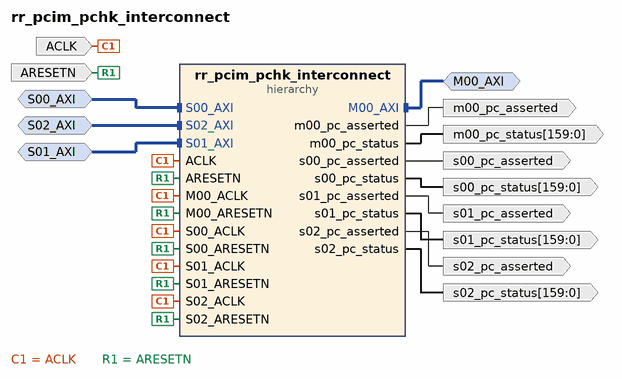
[diagram p0: block diagram of the top level]
# Vivado block design rr_pcim_pchk_interconnect, xcvu9p-flgb2104-2-i, Vivado 2020.2
create_bd_design rr_pcim_pchk_interconnect

create_bd_intf_port -mode Slave -vlnv xilinx.com:interface:aximm_rtl:1.0 S00_AXI
set_property -dict [list \
  CONFIG.ADDR_WIDTH 64 \
  CONFIG.ARUSER_WIDTH 0 \
  CONFIG.AWUSER_WIDTH 0 \
  CONFIG.BUSER_WIDTH 0 \
  CONFIG.DATA_WIDTH 512 \
  CONFIG.FREQ_HZ 250000000 \
  CONFIG.HAS_BRESP 1 \
  CONFIG.HAS_BURST 1 \
  CONFIG.HAS_CACHE 1 \
  CONFIG.HAS_LOCK 1 \
  CONFIG.HAS_PROT 1 \
  CONFIG.HAS_QOS 1 \
  CONFIG.HAS_REGION 1 \
  CONFIG.HAS_RRESP 1 \
  CONFIG.HAS_WSTRB 1 \
  CONFIG.ID_WIDTH 14 \
  CONFIG.MAX_BURST_LENGTH 256 \
  CONFIG.NUM_READ_OUTSTANDING 32 \
  CONFIG.NUM_READ_THREADS 16 \
  CONFIG.NUM_WRITE_OUTSTANDING 32 \
  CONFIG.NUM_WRITE_THREADS 16 \
  CONFIG.PROTOCOL AXI4 \
  CONFIG.READ_WRITE_MODE READ_WRITE \
  CONFIG.RUSER_BITS_PER_BYTE 0 \
  CONFIG.RUSER_WIDTH 0 \
  CONFIG.SUPPORTS_NARROW_BURST 1 \
  CONFIG.WUSER_BITS_PER_BYTE 0 \
  CONFIG.WUSER_WIDTH 0 \
] [get_bd_intf_ports S00_AXI]
create_bd_intf_port -mode Master -vlnv xilinx.com:interface:aximm_rtl:1.0 M00_AXI
set_property -dict [list \
  CONFIG.ADDR_WIDTH 64 \
  CONFIG.DATA_WIDTH 512 \
  CONFIG.FREQ_HZ 250000000 \
  CONFIG.NUM_READ_OUTSTANDING 32 \
  CONFIG.NUM_WRITE_OUTSTANDING 32 \
  CONFIG.PROTOCOL AXI4 \
] [get_bd_intf_ports M00_AXI]
create_bd_intf_port -mode Slave -vlnv xilinx.com:interface:aximm_rtl:1.0 S01_AXI
set_property -dict [list \
  CONFIG.ADDR_WIDTH 64 \
  CONFIG.ARUSER_WIDTH 0 \
  CONFIG.AWUSER_WIDTH 0 \
  CONFIG.BUSER_WIDTH 0 \
  CONFIG.DATA_WIDTH 512 \
  CONFIG.FREQ_HZ 250000000 \
  CONFIG.HAS_BRESP 1 \
  CONFIG.HAS_BURST 1 \
  CONFIG.HAS_CACHE 1 \
  CONFIG.HAS_LOCK 1 \
  CONFIG.HAS_PROT 1 \
  CONFIG.HAS_QOS 1 \
  CONFIG.HAS_REGION 1 \
  CONFIG.HAS_RRESP 1 \
  CONFIG.HAS_WSTRB 1 \
  CONFIG.ID_WIDTH 14 \
  CONFIG.MAX_BURST_LENGTH 256 \
  CONFIG.NUM_READ_OUTSTANDING 32 \
  CONFIG.NUM_READ_THREADS 16 \
  CONFIG.NUM_WRITE_OUTSTANDING 32 \
  CONFIG.NUM_WRITE_THREADS 16 \
  CONFIG.PROTOCOL AXI4 \
  CONFIG.READ_WRITE_MODE READ_WRITE \
  CONFIG.RUSER_BITS_PER_BYTE 0 \
  CONFIG.RUSER_WIDTH 0 \
  CONFIG.SUPPORTS_NARROW_BURST 1 \
  CONFIG.WUSER_BITS_PER_BYTE 0 \
  CONFIG.WUSER_WIDTH 0 \
] [get_bd_intf_ports S01_AXI]
create_bd_intf_port -mode Slave -vlnv xilinx.com:interface:aximm_rtl:1.0 S02_AXI
set_property -dict [list \
  CONFIG.ADDR_WIDTH 64 \
  CONFIG.ARUSER_WIDTH 0 \
  CONFIG.AWUSER_WIDTH 0 \
  CONFIG.BUSER_WIDTH 0 \
  CONFIG.DATA_WIDTH 512 \
  CONFIG.FREQ_HZ 250000000 \
  CONFIG.HAS_BRESP 1 \
  CONFIG.HAS_BURST 1 \
  CONFIG.HAS_CACHE 1 \
  CONFIG.HAS_LOCK 1 \
  CONFIG.HAS_PROT 1 \
  CONFIG.HAS_QOS 1 \
  CONFIG.HAS_REGION 1 \
  CONFIG.HAS_RRESP 1 \
  CONFIG.HAS_WSTRB 1 \
  CONFIG.ID_WIDTH 14 \
  CONFIG.MAX_BURST_LENGTH 256 \
  CONFIG.NUM_READ_OUTSTANDING 32 \
  CONFIG.NUM_READ_THREADS 16 \
  CONFIG.NUM_WRITE_OUTSTANDING 32 \
  CONFIG.NUM_WRITE_THREADS 16 \
  CONFIG.PROTOCOL AXI4 \
  CONFIG.READ_WRITE_MODE READ_WRITE \
  CONFIG.RUSER_BITS_PER_BYTE 0 \
  CONFIG.RUSER_WIDTH 0 \
  CONFIG.SUPPORTS_NARROW_BURST 1 \
  CONFIG.WUSER_BITS_PER_BYTE 0 \
  CONFIG.WUSER_WIDTH 0 \
] [get_bd_intf_ports S02_AXI]
create_bd_port -dir I -type clk ACLK
set_property -dict {CONFIG.ASSOCIATED_BUSIF S00_AXI:M00_AXI:S01_AXI:S02_AXI CONFIG.FREQ_HZ 250000000} [get_bd_ports ACLK]
create_bd_port -dir I -type rst ARESETN
create_bd_port -dir O -from 159 -to 0 s01_pc_status
create_bd_port -dir O s01_pc_asserted
create_bd_port -dir O -from 159 -to 0 s00_pc_status
create_bd_port -dir O s00_pc_asserted
create_bd_port -dir O -from 159 -to 0 s02_pc_status
create_bd_port -dir O s02_pc_asserted
create_bd_port -dir O -from 159 -to 0 m00_pc_status
create_bd_port -dir O m00_pc_asserted

create_bd_cell -type hier rr_pcim_pchk_interconnect
set_property -dict [list \
  CONFIG.ENABLE_ADVANCED_OPTIONS 1 \
  CONFIG.ENABLE_PROTOCOL_CHECKERS 1 \
  CONFIG.M00_HAS_REGSLICE 4 \
  CONFIG.M01_HAS_REGSLICE 4 \
  CONFIG.M02_HAS_REGSLICE 4 \
  CONFIG.M03_HAS_REGSLICE 4 \
  CONFIG.NUM_MI 1 \
  CONFIG.NUM_SI 3 \
  CONFIG.PCHK_MAX_RD_BURSTS 32 \
  CONFIG.PCHK_MAX_WR_BURSTS 32 \
  CONFIG.S00_ARB_PRIORITY 1 \
  CONFIG.S00_HAS_REGSLICE 4 \
  CONFIG.S01_ARB_PRIORITY 1 \
  CONFIG.S01_HAS_REGSLICE 4 \
  CONFIG.S02_HAS_REGSLICE 4 \
] [get_bd_cells rr_pcim_pchk_interconnect]

# ---- hierarchy /rr_pcim_pchk_interconnect ----
current_bd_instance /rr_pcim_pchk_interconnect
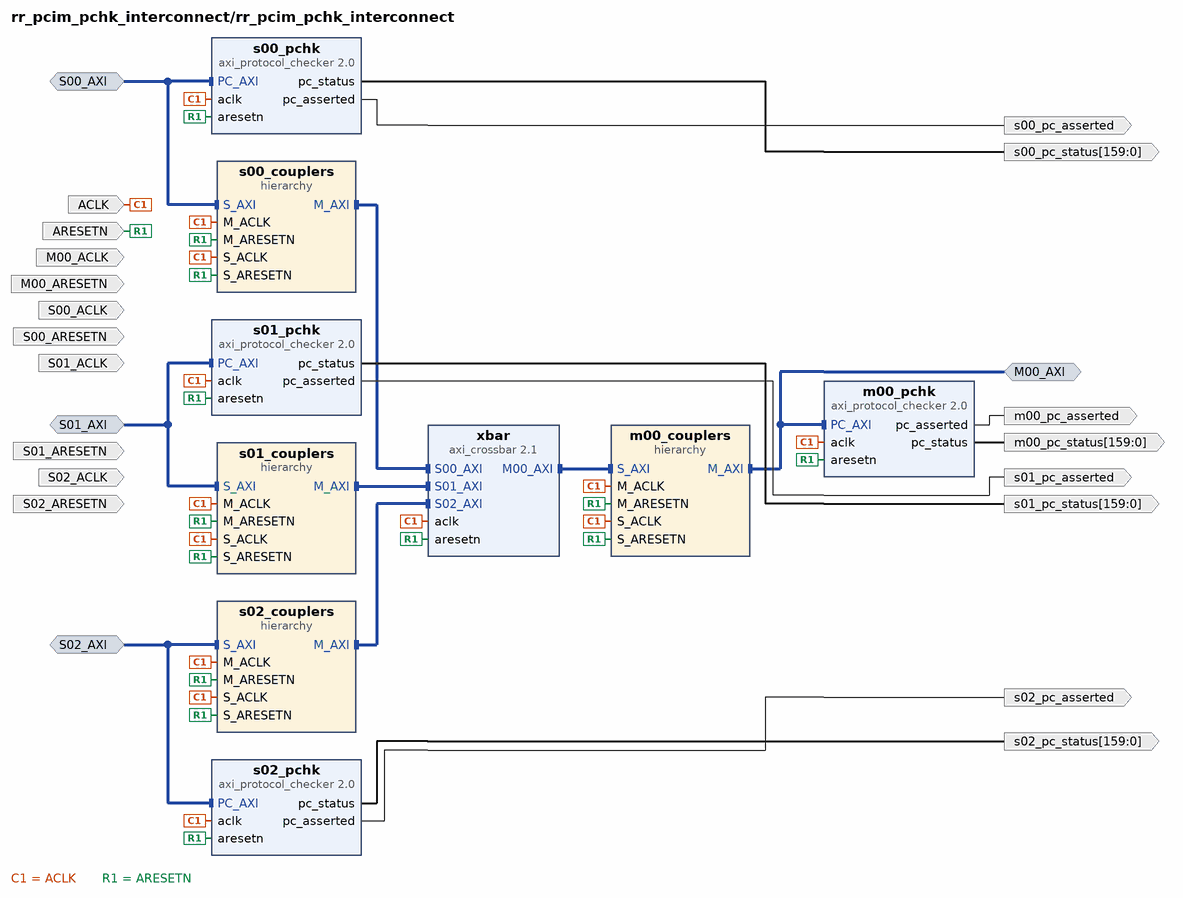
[diagram p1: block diagram inside /rr_pcim_pchk_interconnect]
create_bd_intf_pin -mode Slave -vlnv xilinx.com:interface:aximm_rtl:1.0 S00_AXI
create_bd_intf_pin -mode Master -vlnv xilinx.com:interface:aximm_rtl:1.0 M00_AXI
create_bd_intf_pin -mode Slave -vlnv xilinx.com:interface:aximm_rtl:1.0 S01_AXI
create_bd_intf_pin -mode Slave -vlnv xilinx.com:interface:aximm_rtl:1.0 S02_AXI
create_bd_pin -dir I -type clk ACLK
create_bd_pin -dir I -type rst ARESETN
create_bd_pin -dir I -type clk S00_ACLK
create_bd_pin -dir I -type rst S00_ARESETN
create_bd_pin -dir I -type clk M00_ACLK
create_bd_pin -dir I -type rst M00_ARESETN
create_bd_pin -dir I -type clk S01_ACLK
create_bd_pin -dir I -type rst S01_ARESETN
create_bd_pin -dir I -type clk S02_ACLK
create_bd_pin -dir I -type rst S02_ARESETN
create_bd_pin -dir O -from 159 -to 0 s01_pc_status
create_bd_pin -dir O s01_pc_asserted
create_bd_pin -dir O -from 159 -to 0 s00_pc_status
create_bd_pin -dir O s00_pc_asserted
create_bd_pin -dir O -from 159 -to 0 s02_pc_status
create_bd_pin -dir O s02_pc_asserted
create_bd_pin -dir O -from 159 -to 0 m00_pc_status
create_bd_pin -dir O m00_pc_asserted

create_bd_cell -type ip -vlnv xilinx.com:ip:axi_crossbar:2.1 xbar
set_property -dict [list \
  CONFIG.NUM_MI 1 \
  CONFIG.NUM_SI 3 \
  CONFIG.S00_ARB_PRIORITY 1 \
  CONFIG.S01_ARB_PRIORITY 1 \
  CONFIG.S02_ARB_PRIORITY 0 \
  CONFIG.STRATEGY 0 \
] [get_bd_cells xbar]
create_bd_cell -type hier s00_couplers
create_bd_cell -type hier s01_couplers
create_bd_cell -type hier s02_couplers
create_bd_cell -type hier m00_couplers
create_bd_cell -type ip -vlnv xilinx.com:ip:axi_protocol_checker:2.0 s00_pchk
set_property -dict [list \
  CONFIG.MAX_AR_WAITS 0 \
  CONFIG.MAX_AW_WAITS 0 \
  CONFIG.MAX_B_WAITS 0 \
  CONFIG.MAX_RD_BURSTS 32 \
  CONFIG.MAX_R_WAITS 0 \
  CONFIG.MAX_WR_BURSTS 32 \
  CONFIG.MAX_W_WAITS 0 \
] [get_bd_cells s00_pchk]
create_bd_cell -type ip -vlnv xilinx.com:ip:axi_protocol_checker:2.0 s01_pchk
set_property -dict [list \
  CONFIG.MAX_AR_WAITS 0 \
  CONFIG.MAX_AW_WAITS 0 \
  CONFIG.MAX_B_WAITS 0 \
  CONFIG.MAX_RD_BURSTS 32 \
  CONFIG.MAX_R_WAITS 0 \
  CONFIG.MAX_WR_BURSTS 32 \
  CONFIG.MAX_W_WAITS 0 \
] [get_bd_cells s01_pchk]
create_bd_cell -type ip -vlnv xilinx.com:ip:axi_protocol_checker:2.0 s02_pchk
set_property -dict [list \
  CONFIG.MAX_AR_WAITS 0 \
  CONFIG.MAX_AW_WAITS 0 \
  CONFIG.MAX_B_WAITS 0 \
  CONFIG.MAX_RD_BURSTS 32 \
  CONFIG.MAX_R_WAITS 0 \
  CONFIG.MAX_WR_BURSTS 32 \
  CONFIG.MAX_W_WAITS 0 \
] [get_bd_cells s02_pchk]
create_bd_cell -type ip -vlnv xilinx.com:ip:axi_protocol_checker:2.0 m00_pchk
set_property -dict [list \
  CONFIG.MAX_AR_WAITS 0 \
  CONFIG.MAX_AW_WAITS 0 \
  CONFIG.MAX_B_WAITS 0 \
  CONFIG.MAX_RD_BURSTS 32 \
  CONFIG.MAX_R_WAITS 0 \
  CONFIG.MAX_WR_BURSTS 32 \
  CONFIG.MAX_W_WAITS 0 \
] [get_bd_cells m00_pchk]

# ---- hierarchy /rr_pcim_pchk_interconnect/s00_couplers ----
current_bd_instance /rr_pcim_pchk_interconnect/s00_couplers
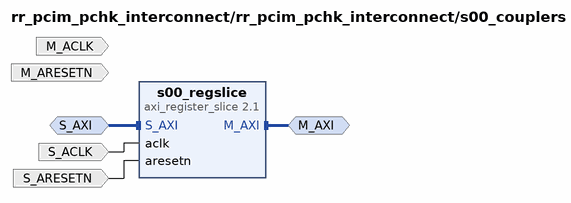
[diagram p2: block diagram inside /rr_pcim_pchk_interconnect/s00_couplers]
create_bd_intf_pin -mode Master -vlnv xilinx.com:interface:aximm_rtl:1.0 M_AXI
create_bd_intf_pin -mode Slave -vlnv xilinx.com:interface:aximm_rtl:1.0 S_AXI
create_bd_pin -dir I -type clk M_ACLK
create_bd_pin -dir I -type rst M_ARESETN
create_bd_pin -dir I -type clk S_ACLK
create_bd_pin -dir I -type rst S_ARESETN

create_bd_cell -type ip -vlnv xilinx.com:ip:axi_register_slice:2.1 s00_regslice

# ---- hierarchy /rr_pcim_pchk_interconnect/s01_couplers ----
current_bd_instance /rr_pcim_pchk_interconnect/s01_couplers
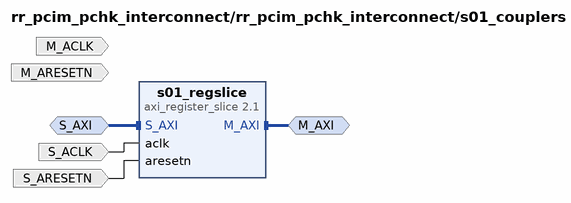
[diagram p3: block diagram inside /rr_pcim_pchk_interconnect/s01_couplers]
create_bd_intf_pin -mode Master -vlnv xilinx.com:interface:aximm_rtl:1.0 M_AXI
create_bd_intf_pin -mode Slave -vlnv xilinx.com:interface:aximm_rtl:1.0 S_AXI
create_bd_pin -dir I -type clk M_ACLK
create_bd_pin -dir I -type rst M_ARESETN
create_bd_pin -dir I -type clk S_ACLK
create_bd_pin -dir I -type rst S_ARESETN

create_bd_cell -type ip -vlnv xilinx.com:ip:axi_register_slice:2.1 s01_regslice

# ---- hierarchy /rr_pcim_pchk_interconnect/s02_couplers ----
current_bd_instance /rr_pcim_pchk_interconnect/s02_couplers
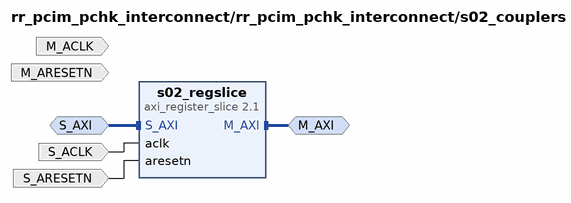
[diagram p4: block diagram inside /rr_pcim_pchk_interconnect/s02_couplers]
create_bd_intf_pin -mode Master -vlnv xilinx.com:interface:aximm_rtl:1.0 M_AXI
create_bd_intf_pin -mode Slave -vlnv xilinx.com:interface:aximm_rtl:1.0 S_AXI
create_bd_pin -dir I -type clk M_ACLK
create_bd_pin -dir I -type rst M_ARESETN
create_bd_pin -dir I -type clk S_ACLK
create_bd_pin -dir I -type rst S_ARESETN

create_bd_cell -type ip -vlnv xilinx.com:ip:axi_register_slice:2.1 s02_regslice

# ---- hierarchy /rr_pcim_pchk_interconnect/m00_couplers ----
current_bd_instance /rr_pcim_pchk_interconnect/m00_couplers
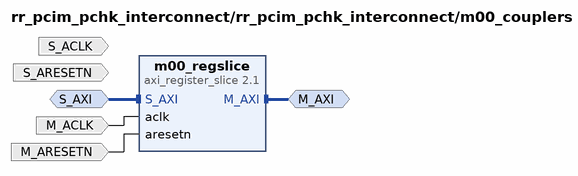
[diagram p5: block diagram inside /rr_pcim_pchk_interconnect/m00_couplers]
create_bd_intf_pin -mode Master -vlnv xilinx.com:interface:aximm_rtl:1.0 M_AXI
create_bd_intf_pin -mode Slave -vlnv xilinx.com:interface:aximm_rtl:1.0 S_AXI
create_bd_pin -dir I -type clk M_ACLK
create_bd_pin -dir I -type rst M_ARESETN
create_bd_pin -dir I -type clk S_ACLK
create_bd_pin -dir I -type rst S_ARESETN

create_bd_cell -type ip -vlnv xilinx.com:ip:axi_register_slice:2.1 m00_regslice

# ---- connections ----

current_bd_instance /rr_pcim_pchk_interconnect
connect_bd_intf_net [get_bd_intf_pins xbar/M00_AXI] [get_bd_intf_pins m00_couplers/S_AXI]
connect_bd_intf_net [get_bd_intf_pins s00_couplers/M_AXI] [get_bd_intf_pins xbar/S00_AXI]
connect_bd_intf_net -intf_net rr_pcim_pchk_interconnect_to_s01_couplers [get_bd_intf_pins S01_AXI] [get_bd_intf_pins s01_couplers/S_AXI]
connect_bd_intf_net [get_bd_intf_pins S01_AXI] [get_bd_intf_pins s01_pchk/PC_AXI]
connect_bd_intf_net -intf_net rr_pcim_pchk_interconnect_to_s00_couplers [get_bd_intf_pins S00_AXI] [get_bd_intf_pins s00_couplers/S_AXI]
connect_bd_intf_net [get_bd_intf_pins S00_AXI] [get_bd_intf_pins s00_pchk/PC_AXI]
connect_bd_intf_net -intf_net m00_couplers_to_rr_pcim_pchk_interconnect [get_bd_intf_pins M00_AXI] [get_bd_intf_pins m00_couplers/M_AXI]
connect_bd_intf_net [get_bd_intf_pins M00_AXI] [get_bd_intf_pins m00_pchk/PC_AXI]
connect_bd_intf_net -intf_net rr_pcim_pchk_interconnect_to_s02_couplers [get_bd_intf_pins S02_AXI] [get_bd_intf_pins s02_couplers/S_AXI]
connect_bd_intf_net [get_bd_intf_pins S02_AXI] [get_bd_intf_pins s02_pchk/PC_AXI]
connect_bd_intf_net [get_bd_intf_pins s02_couplers/M_AXI] [get_bd_intf_pins xbar/S02_AXI]
connect_bd_intf_net [get_bd_intf_pins s01_couplers/M_AXI] [get_bd_intf_pins xbar/S01_AXI]
connect_bd_net -net rr_pcim_pchk_interconnect_ACLK_net [get_bd_pins ACLK] \
  [get_bd_pins xbar/aclk] [get_bd_pins s00_couplers/S_ACLK] [get_bd_pins s01_couplers/S_ACLK] \
  [get_bd_pins s02_couplers/S_ACLK] [get_bd_pins s00_couplers/M_ACLK] [get_bd_pins s01_couplers/M_ACLK] \
  [get_bd_pins s02_couplers/M_ACLK] [get_bd_pins m00_couplers/M_ACLK] [get_bd_pins m00_couplers/S_ACLK] \
  [get_bd_pins s00_pchk/aclk] [get_bd_pins s01_pchk/aclk] [get_bd_pins s02_pchk/aclk] [get_bd_pins m00_pchk/aclk]
connect_bd_net -net rr_pcim_pchk_interconnect_ARESETN_net [get_bd_pins ARESETN] \
  [get_bd_pins xbar/aresetn] [get_bd_pins s00_couplers/S_ARESETN] [get_bd_pins s01_couplers/S_ARESETN] \
  [get_bd_pins s02_couplers/S_ARESETN] [get_bd_pins s00_couplers/M_ARESETN] [get_bd_pins s01_couplers/M_ARESETN] \
  [get_bd_pins s02_couplers/M_ARESETN] [get_bd_pins m00_couplers/M_ARESETN] [get_bd_pins m00_couplers/S_ARESETN] \
  [get_bd_pins s00_pchk/aresetn] [get_bd_pins s01_pchk/aresetn] [get_bd_pins s02_pchk/aresetn] [get_bd_pins m00_pchk/aresetn]
connect_bd_net [get_bd_pins s01_pchk/pc_status] [get_bd_pins s01_pc_status]
connect_bd_net [get_bd_pins s01_pchk/pc_asserted] [get_bd_pins s01_pc_asserted]
connect_bd_net [get_bd_pins s00_pchk/pc_status] [get_bd_pins s00_pc_status]
connect_bd_net [get_bd_pins s00_pchk/pc_asserted] [get_bd_pins s00_pc_asserted]
connect_bd_net [get_bd_pins s02_pchk/pc_status] [get_bd_pins s02_pc_status]
connect_bd_net [get_bd_pins s02_pchk/pc_asserted] [get_bd_pins s02_pc_asserted]
connect_bd_net [get_bd_pins m00_pchk/pc_status] [get_bd_pins m00_pc_status]
connect_bd_net [get_bd_pins m00_pchk/pc_asserted] [get_bd_pins m00_pc_asserted]
set_property HDL_ATTRIBUTE.MARK_DEBUG true [get_bd_intf_nets rr_pcim_pchk_interconnect_to_s01_couplers]
set_property HDL_ATTRIBUTE.MARK_DEBUG true [get_bd_intf_nets rr_pcim_pchk_interconnect_to_s00_couplers]
set_property HDL_ATTRIBUTE.MARK_DEBUG true [get_bd_intf_nets m00_couplers_to_rr_pcim_pchk_interconnect]
set_property HDL_ATTRIBUTE.MARK_DEBUG true [get_bd_intf_nets rr_pcim_pchk_interconnect_to_s02_couplers]
set_property HDL_ATTRIBUTE.MARK_DEBUG true [get_bd_nets rr_pcim_pchk_interconnect_ARESETN_net]

current_bd_instance /rr_pcim_pchk_interconnect/s00_couplers
connect_bd_intf_net [get_bd_intf_pins S_AXI] [get_bd_intf_pins s00_regslice/S_AXI]
connect_bd_intf_net [get_bd_intf_pins M_AXI] [get_bd_intf_pins s00_regslice/M_AXI]
connect_bd_net [get_bd_pins S_ACLK] [get_bd_pins s00_regslice/aclk]
connect_bd_net [get_bd_pins S_ARESETN] [get_bd_pins s00_regslice/aresetn]

current_bd_instance /rr_pcim_pchk_interconnect/s01_couplers
connect_bd_intf_net [get_bd_intf_pins S_AXI] [get_bd_intf_pins s01_regslice/S_AXI]
connect_bd_intf_net [get_bd_intf_pins M_AXI] [get_bd_intf_pins s01_regslice/M_AXI]
connect_bd_net [get_bd_pins S_ACLK] [get_bd_pins s01_regslice/aclk]
connect_bd_net [get_bd_pins S_ARESETN] [get_bd_pins s01_regslice/aresetn]

current_bd_instance /rr_pcim_pchk_interconnect/s02_couplers
connect_bd_intf_net [get_bd_intf_pins S_AXI] [get_bd_intf_pins s02_regslice/S_AXI]
connect_bd_intf_net [get_bd_intf_pins M_AXI] [get_bd_intf_pins s02_regslice/M_AXI]
connect_bd_net [get_bd_pins S_ACLK] [get_bd_pins s02_regslice/aclk]
connect_bd_net [get_bd_pins S_ARESETN] [get_bd_pins s02_regslice/aresetn]

current_bd_instance /rr_pcim_pchk_interconnect/m00_couplers
connect_bd_intf_net [get_bd_intf_pins M_AXI] [get_bd_intf_pins m00_regslice/M_AXI]
connect_bd_intf_net [get_bd_intf_pins S_AXI] [get_bd_intf_pins m00_regslice/S_AXI]
connect_bd_net [get_bd_pins M_ACLK] [get_bd_pins m00_regslice/aclk]
connect_bd_net [get_bd_pins M_ARESETN] [get_bd_pins m00_regslice/aresetn]

current_bd_instance /
connect_bd_intf_net -intf_net axi_interconnect_0_M00_AXI [get_bd_intf_ports M00_AXI] [get_bd_intf_pins rr_pcim_pchk_interconnect/M00_AXI]
connect_bd_intf_net [get_bd_intf_ports S00_AXI] [get_bd_intf_pins rr_pcim_pchk_interconnect/S00_AXI]
connect_bd_intf_net [get_bd_intf_ports S02_AXI] [get_bd_intf_pins rr_pcim_pchk_interconnect/S02_AXI]
connect_bd_intf_net [get_bd_intf_ports S01_AXI] [get_bd_intf_pins rr_pcim_pchk_interconnect/S01_AXI]
connect_bd_net [get_bd_ports ACLK] \
  [get_bd_pins rr_pcim_pchk_interconnect/ACLK] [get_bd_pins rr_pcim_pchk_interconnect/S00_ACLK] \
  [get_bd_pins rr_pcim_pchk_interconnect/S01_ACLK] [get_bd_pins rr_pcim_pchk_interconnect/M00_ACLK] \
  [get_bd_pins rr_pcim_pchk_interconnect/S02_ACLK]
connect_bd_net [get_bd_ports ARESETN] \
  [get_bd_pins rr_pcim_pchk_interconnect/ARESETN] [get_bd_pins rr_pcim_pchk_interconnect/S00_ARESETN] \
  [get_bd_pins rr_pcim_pchk_interconnect/S01_ARESETN] [get_bd_pins rr_pcim_pchk_interconnect/M00_ARESETN] \
  [get_bd_pins rr_pcim_pchk_interconnect/S02_ARESETN]
connect_bd_net [get_bd_pins rr_pcim_pchk_interconnect/s01_pc_status] [get_bd_ports s01_pc_status]
connect_bd_net [get_bd_pins rr_pcim_pchk_interconnect/s01_pc_asserted] [get_bd_ports s01_pc_asserted]
connect_bd_net [get_bd_pins rr_pcim_pchk_interconnect/s00_pc_status] [get_bd_ports s00_pc_status]
connect_bd_net [get_bd_pins rr_pcim_pchk_interconnect/s00_pc_asserted] [get_bd_ports s00_pc_asserted]
connect_bd_net [get_bd_pins rr_pcim_pchk_interconnect/s02_pc_status] [get_bd_ports s02_pc_status]
connect_bd_net [get_bd_pins rr_pcim_pchk_interconnect/s02_pc_asserted] [get_bd_ports s02_pc_asserted]
connect_bd_net [get_bd_pins rr_pcim_pchk_interconnect/m00_pc_status] [get_bd_ports m00_pc_status]
connect_bd_net [get_bd_pins rr_pcim_pchk_interconnect/m00_pc_asserted] [get_bd_ports m00_pc_asserted]

# ---- address map ----
assign_bd_address -offset 0x0000000000000000 -range 16E -target_address_space [get_bd_addr_spaces S00_AXI] [get_bd_addr_segs M00_AXI/Reg]
assign_bd_address -offset 0x0000000000000000 -range 16E -target_address_space [get_bd_addr_spaces S01_AXI] [get_bd_addr_segs M00_AXI/Reg]
assign_bd_address -offset 0x0000000000000000 -range 16E -target_address_space [get_bd_addr_spaces S02_AXI] [get_bd_addr_segs M00_AXI/Reg]

validate_bd_design
save_bd_design
